# Altium project CommonBoard_FK_H743.PrjPCB
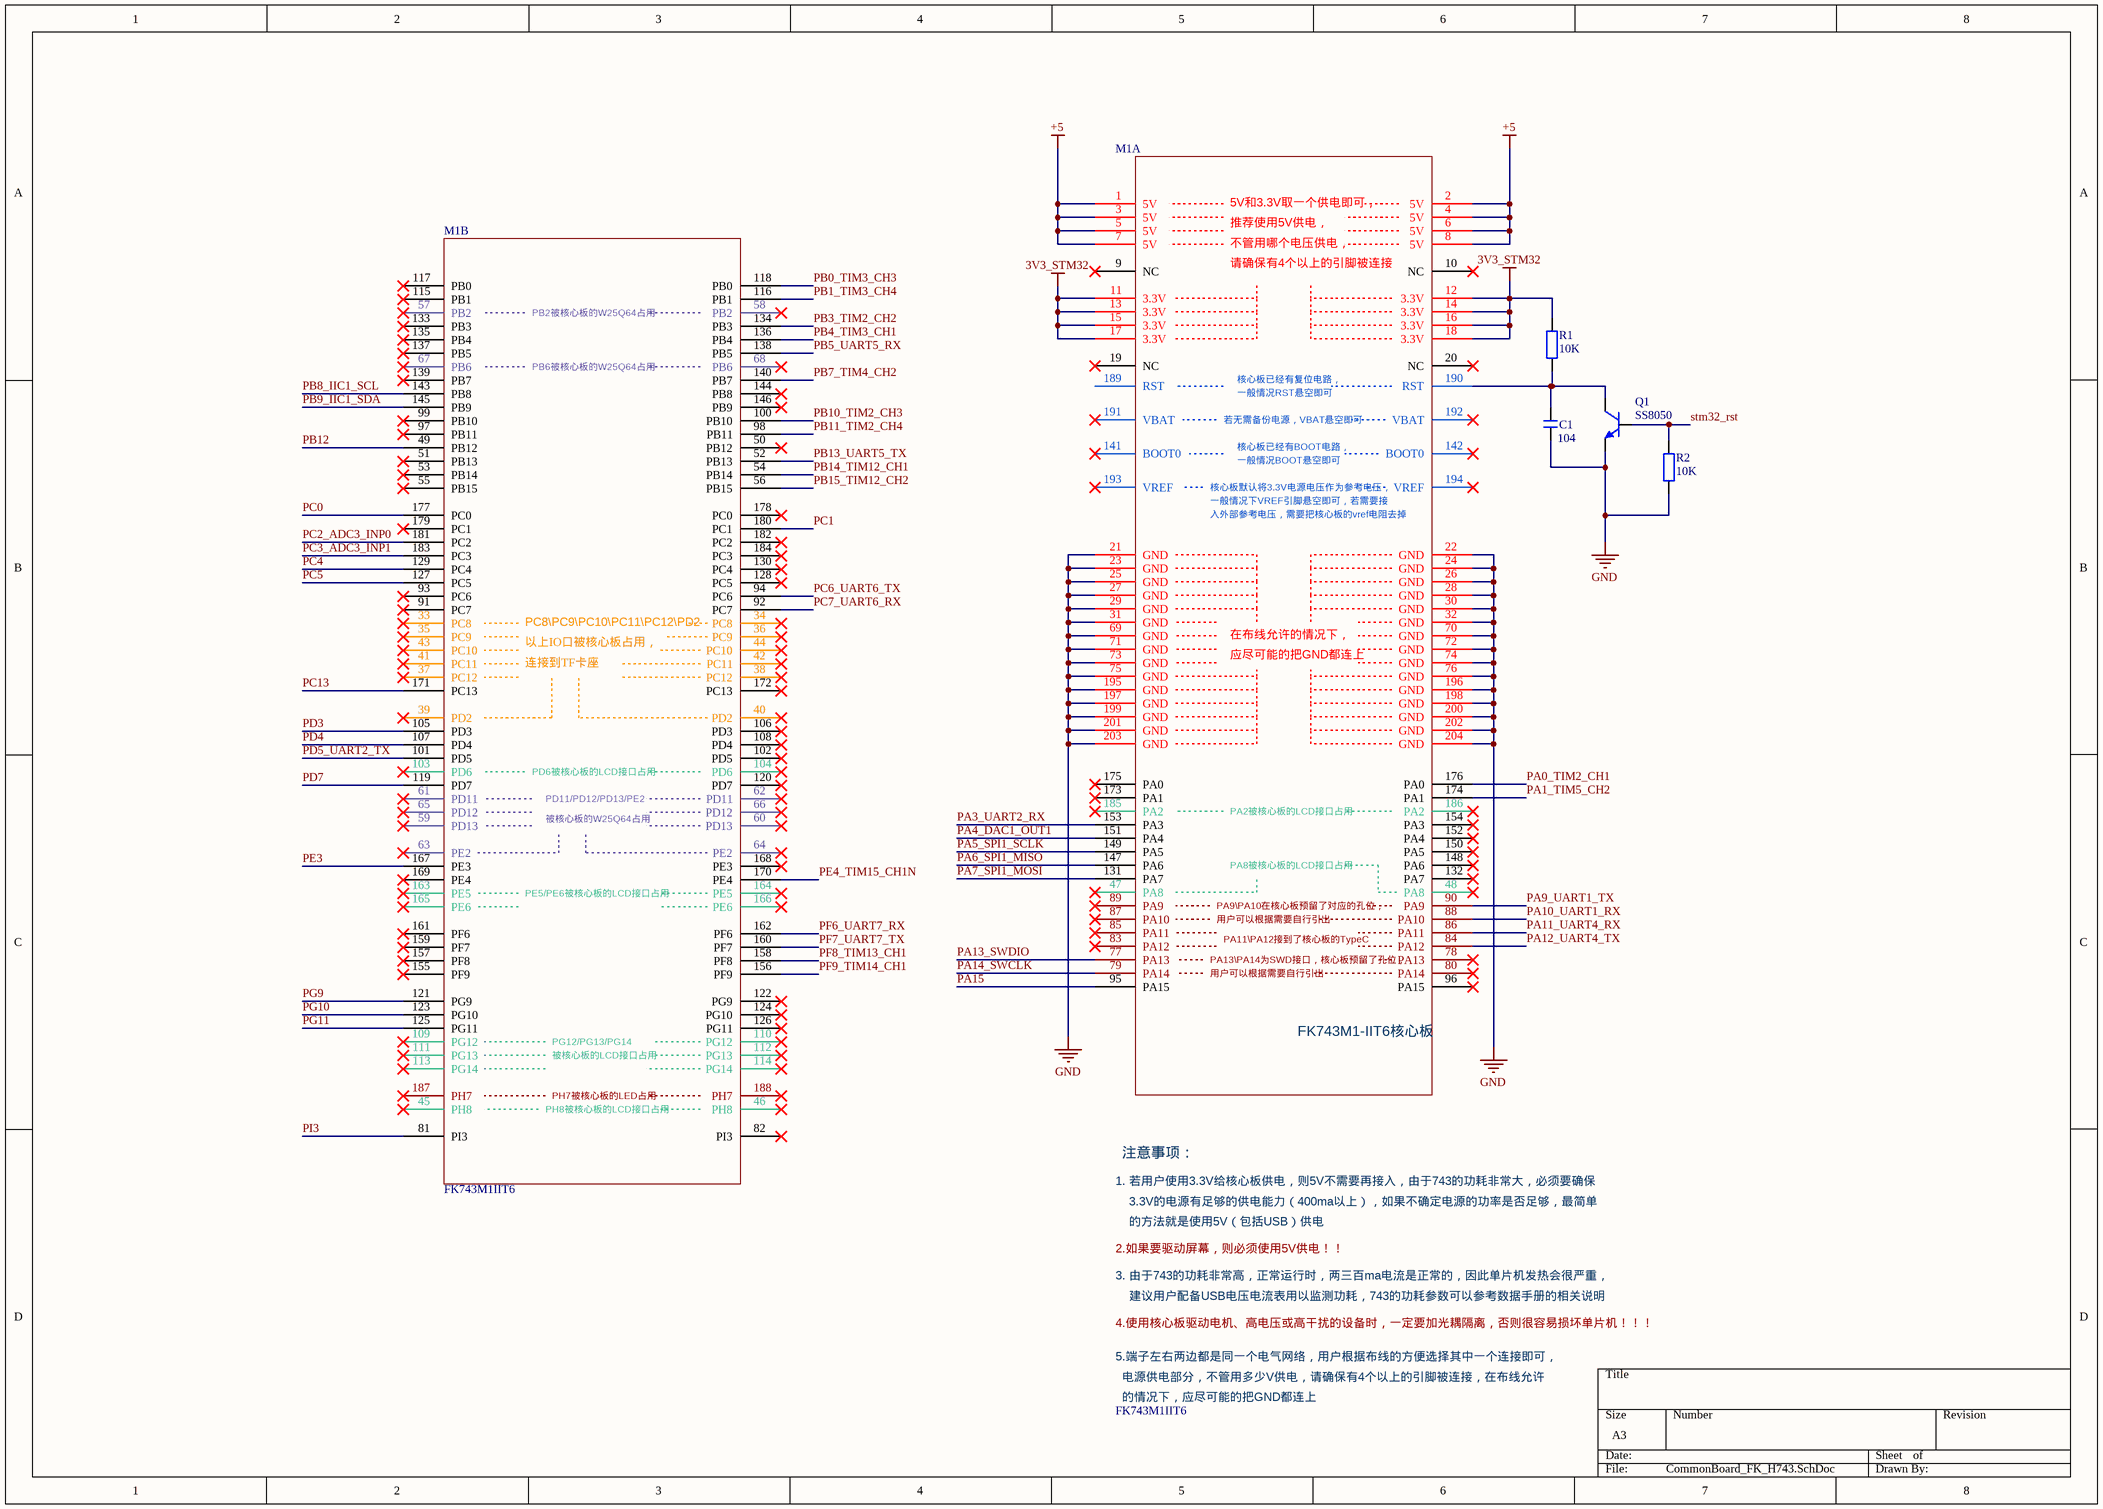
[diagram p0: CommonBoard_FK_H743.SchDoc]
2 sheets, 38 parts. Net scope: global (net labels, ports and power ports of the same name join across sheets).
Board file: CommonBoard_FK_H743.PcbDoc
Sheets:
  CommonBoard_FK_H743.SchDoc
  CommonBoard_FK_H743_out.SchDoc

## Sheet CommonBoard_FK_H743.SchDoc
size A3

### Parts
C1  104  [C 0603_L]
M1  FK743M1IIT6  [FK743M1-IIT6]  (parts A,B of 2)
Q1  SS8050  [SOT23-3N]
R1  10K  [R 0603_L]
R2  10K  [R 0603_L]

### Nets
3V3_STM32: M1.11(3.3V) M1.12(3.3V) M1.13(3.3V) M1.14(3.3V) M1.15(3.3V) M1.16(3.3V) M1.17(3.3V) M1.18(3.3V) R1.2
+5: M1.1(5V) M1.2(5V) M1.3(5V) M1.4(5V) M1.5(5V) M1.6(5V) M1.7(5V) M1.8(5V)
GND: C1.1 M1.21(GND) M1.22(GND) M1.23(GND) M1.24(GND) M1.25(GND) M1.26(GND) M1.27(GND) M1.28(GND) M1.29(GND) M1.30(GND) M1.31(GND) M1.32(GND) M1.69(GND) M1.70(GND) M1.71(GND) M1.72(GND) M1.73(GND) M1.74(GND) M1.75(GND) M1.76(GND) M1.195(GND) M1.196(GND) M1.197(GND) M1.198(GND) M1.199(GND) M1.200(GND) M1.201(GND) M1.202(GND) M1.203(GND) M1.204(GND) Q1.2(E) R2.1
PA0_TIM2_CH1: M1.176(PA0)
PA1_TIM5_CH2: M1.174(PA1)
PA3_UART2_RX: M1.153(PA3)
PA4_DAC1_OUT1: M1.151(PA4)
PA5_SPI1_SCLK: M1.149(PA5)
PA6_SPI1_MISO: M1.147(PA6)
PA7_SPI1_MOSI: M1.131(PA7)
PA9_UART1_TX: M1.90(PA9)
PA10_UART1_RX: M1.88(PA10)
PA11_UART4_RX: M1.86(PA11)
PA12_UART4_TX: M1.84(PA12)
PA13_SWDIO: M1.77(PA13)
PA14_SWCLK: M1.79(PA14)
PA15: M1.95(PA15)
PB0_TIM3_CH3: M1.118(PB0)
PB1_TIM3_CH4: M1.116(PB1)
PB3_TIM2_CH2: M1.134(PB3)
PB4_TIM3_CH1: M1.136(PB4)
PB5_UART5_RX: M1.138(PB5)
PB7_TIM4_CH2: M1.140(PB7)
PB8_IIC1_SCL: M1.143(PB8)
PB9_IIC1_SDA: M1.145(PB9)
PB10_TIM2_CH3: M1.100(PB10)
PB11_TIM2_CH4: M1.98(PB11)
PB12: M1.49(PB12)
PB13_UART5_TX: M1.52(PB13)
PB14_TIM12_CH1: M1.54(PB14)
PB15_TIM12_CH2: M1.56(PB15)
PC0: M1.177(PC0)
PC1: M1.180(PC1)
PC2_ADC3_INP0: M1.181(PC2)
PC3_ADC3_INP1: M1.183(PC3)
PC4: M1.129(PC4)
PC5: M1.127(PC5)
PC6_UART6_TX: M1.94(PC6)
PC7_UART6_RX: M1.92(PC7)
PC13: M1.171(PC13)
PD3: M1.105(PD3)
PD4: M1.107(PD4)
PD5_UART2_TX: M1.101(PD5)
PD7: M1.119(PD7)
PE3: M1.167(PE3)
PE4_TIM15_CH1N: M1.170(PE4)
PF6_UART7_RX: M1.162(PF6)
PF7_UART7_TX: M1.160(PF7)
PF8_TIM13_CH1: M1.158(PF8)
PF9_TIM14_CH1: M1.156(PF9)
PG9: M1.121(PG9)
PG10: M1.123(PG10)
PG11: M1.125(PG11)
PI3: M1.81(PI3)
stm32_rst: Q1.1(B) R2.2
NetC1_2: C1.2 M1.190(RST) Q1.3(C) R1.1

Not connected (* = marked no-connect by the designer): M1 9(NC)* 10(NC)* 19(NC)* 20(NC)* 33(PC8)* 34(PC8)* 35(PC9)* 36(PC9)* 37(PC12)* 38(PC12)* 39(PD2)* 40(PD2)* 41(PC11)* 42(PC11)* 43(PC10)* 44(PC10)* 45(PH8)* 46(PH8)* 47(PA8)* 48(PA8)* 50(PB12)* 51(PB13)* 53(PB14)* 55(PB15)* 57(PB2)* 58(PB2)* 59(PD13)* 60(PD13)* 61(PD11)* 62(PD11)* 63(PE2)* 64(PE2)* 65(PD12)* 66(PD12)* 67(PB6)* 68(PB6)* 78(PA13)* 80(PA14)* 82(PI3)* 83(PA12)* 85(PA11)* 87(PA10)* 89(PA9)* 91(PC7)* 93(PC6)* 96(PA15)* 97(PB11)* 99(PB10)* 102(PD5)* 103(PD6)* 104(PD6)* 106(PD3)* 108(PD4)* 109(PG12)* 110(PG12)* 111(PG13)* 112(PG13)* 113(PG14)* 114(PG14)* 115(PB1)* 117(PB0)* 120(PD7)* 122(PG9)* 124(PG10)* 126(PG11)* 128(PC5)* 130(PC4)* 132(PA7)* 133(PB3)* 135(PB4)* 137(PB5)* 139(PB7)* 141(BOOT0)* 142(BOOT0)* 144(PB8)* 146(PB9)* 148(PA6)* 150(PA5)* 152(PA4)* 154(PA3)* 155(PF9)* 157(PF8)* 159(PF7)* 161(PF6)* 163(PE5)* 164(PE5)* 165(PE6)* 166(PE6)* 168(PE3)* 169(PE4)* 172(PC13)* 173(PA1)* 175(PA0)* 178(PC0)* 179(PC1)* 182(PC2)* 184(PC3)* 185(PA2)* 186(PA2)* 187(PH7)* 188(PH7)* 189(RST) 191(VBAT)* 192(VBAT)* 193(VREF)* 194(VREF)*

### Notes on the sheet
- (in symbol FK743M1-IIT6, part A) 5V和3.3V取一个供电即可，; 推荐使用5V供电，; 不管用哪个电压供电，; 请确保有4个以上的引脚被连接; 核心板已经有复位电路，; 一般情况RST悬空即可; 若无需备份电源，VBAT悬空即可; 核心板已经有BOOT电路，; 一般情况BOOT悬空即可; 核心板默认将3.3V电源电压作为参考电压，; 一般情况下VREF引脚悬空即可，若需要接; 入外部参考电压，需要把核心板的vref电阻去掉; 在布线允许的情况下，; 应尽可能的把GND都连上; PA2被核心板的LCD接口占用; PA8被核心板的LCD接口占用; PA9\PA10在核心板预留了对应的孔位，; 用户可以根据需要自行引出; PA11\PA12接到了核心板的TypeC; PA13\PA14为SWD接口，核心板预留了孔位，; FK743M1-IIT6核心板; 注意事项：; 1. 若用户使用3.3V给核心板供电，则5V不需要再接入，由于743的功耗非常大，必须要确保; 3.3V的电源有足够的供电能力（400ma以上），如果不确定电源的功率是否足够，最简单; 的方法就是使用5V（包括USB）供电; 2.如果要驱动屏幕，则必须使用5V供电！！; 3. 由于743的功耗非常高，正常运行时，两三百ma电流是正常的，因此单片机发热会很严重，; 建议用户配备USB电压电流表用以监测功耗，743的功耗参数可以参考数据手册的相关说明; 4.使用核心板驱动电机、高电压或高干扰的设备时，一定要加光耦隔离，否则很容易损坏单片机！！！; 5.端子左右两边都是同一个电气网络，用户根据布线的方便选择其中一个连接即可，; 电源供电部分，不管用多少V供电，请确保有4个以上的引脚被连接，在布线允许; 的情况下，应尽可能的把GND都连上
- (in symbol FK743M1-IIT6, part B) PB2被核心板的W25Q64占用; PB6被核心板的W25Q64占用; PC8\PC9\PC10\PC11\PC12\PD2; 以上IO口被核心板占用，; 连接到TF卡座; PD6被核心板的LCD接口占用; PD11/PD12/PD13/PE2; 被核心板的W25Q64占用; PE5/PE6被核心板的LCD接口占用; PG12/PG13/PG14; 被核心板的LCD接口占用; PH7被核心板的LED占用; PH8被核心板的LCD接口占用

### Library data of the parts
C1 = C: 无极性贴片电容; 版权归属: 源创客; BOM名称: 无极性贴片电容; 学习资源: www.ooocke.com
M1 = FK743M1-IIT6
Q1 = 8050-SMD: 高频放大-NPN型; 版权归属: 源创客; 属性: 40V 1.5A 1W 100MHZ; BOM名称: 高频放大-NPN型; 学习资源: www.ooocke.com
R1 R2 = R: 贴片电阻; 版权归属: 源创客; BOM名称: 贴片电阻; 学习资源: www.ooocke.com

## Sheet CommonBoard_FK_H743_out.SchDoc
size A3
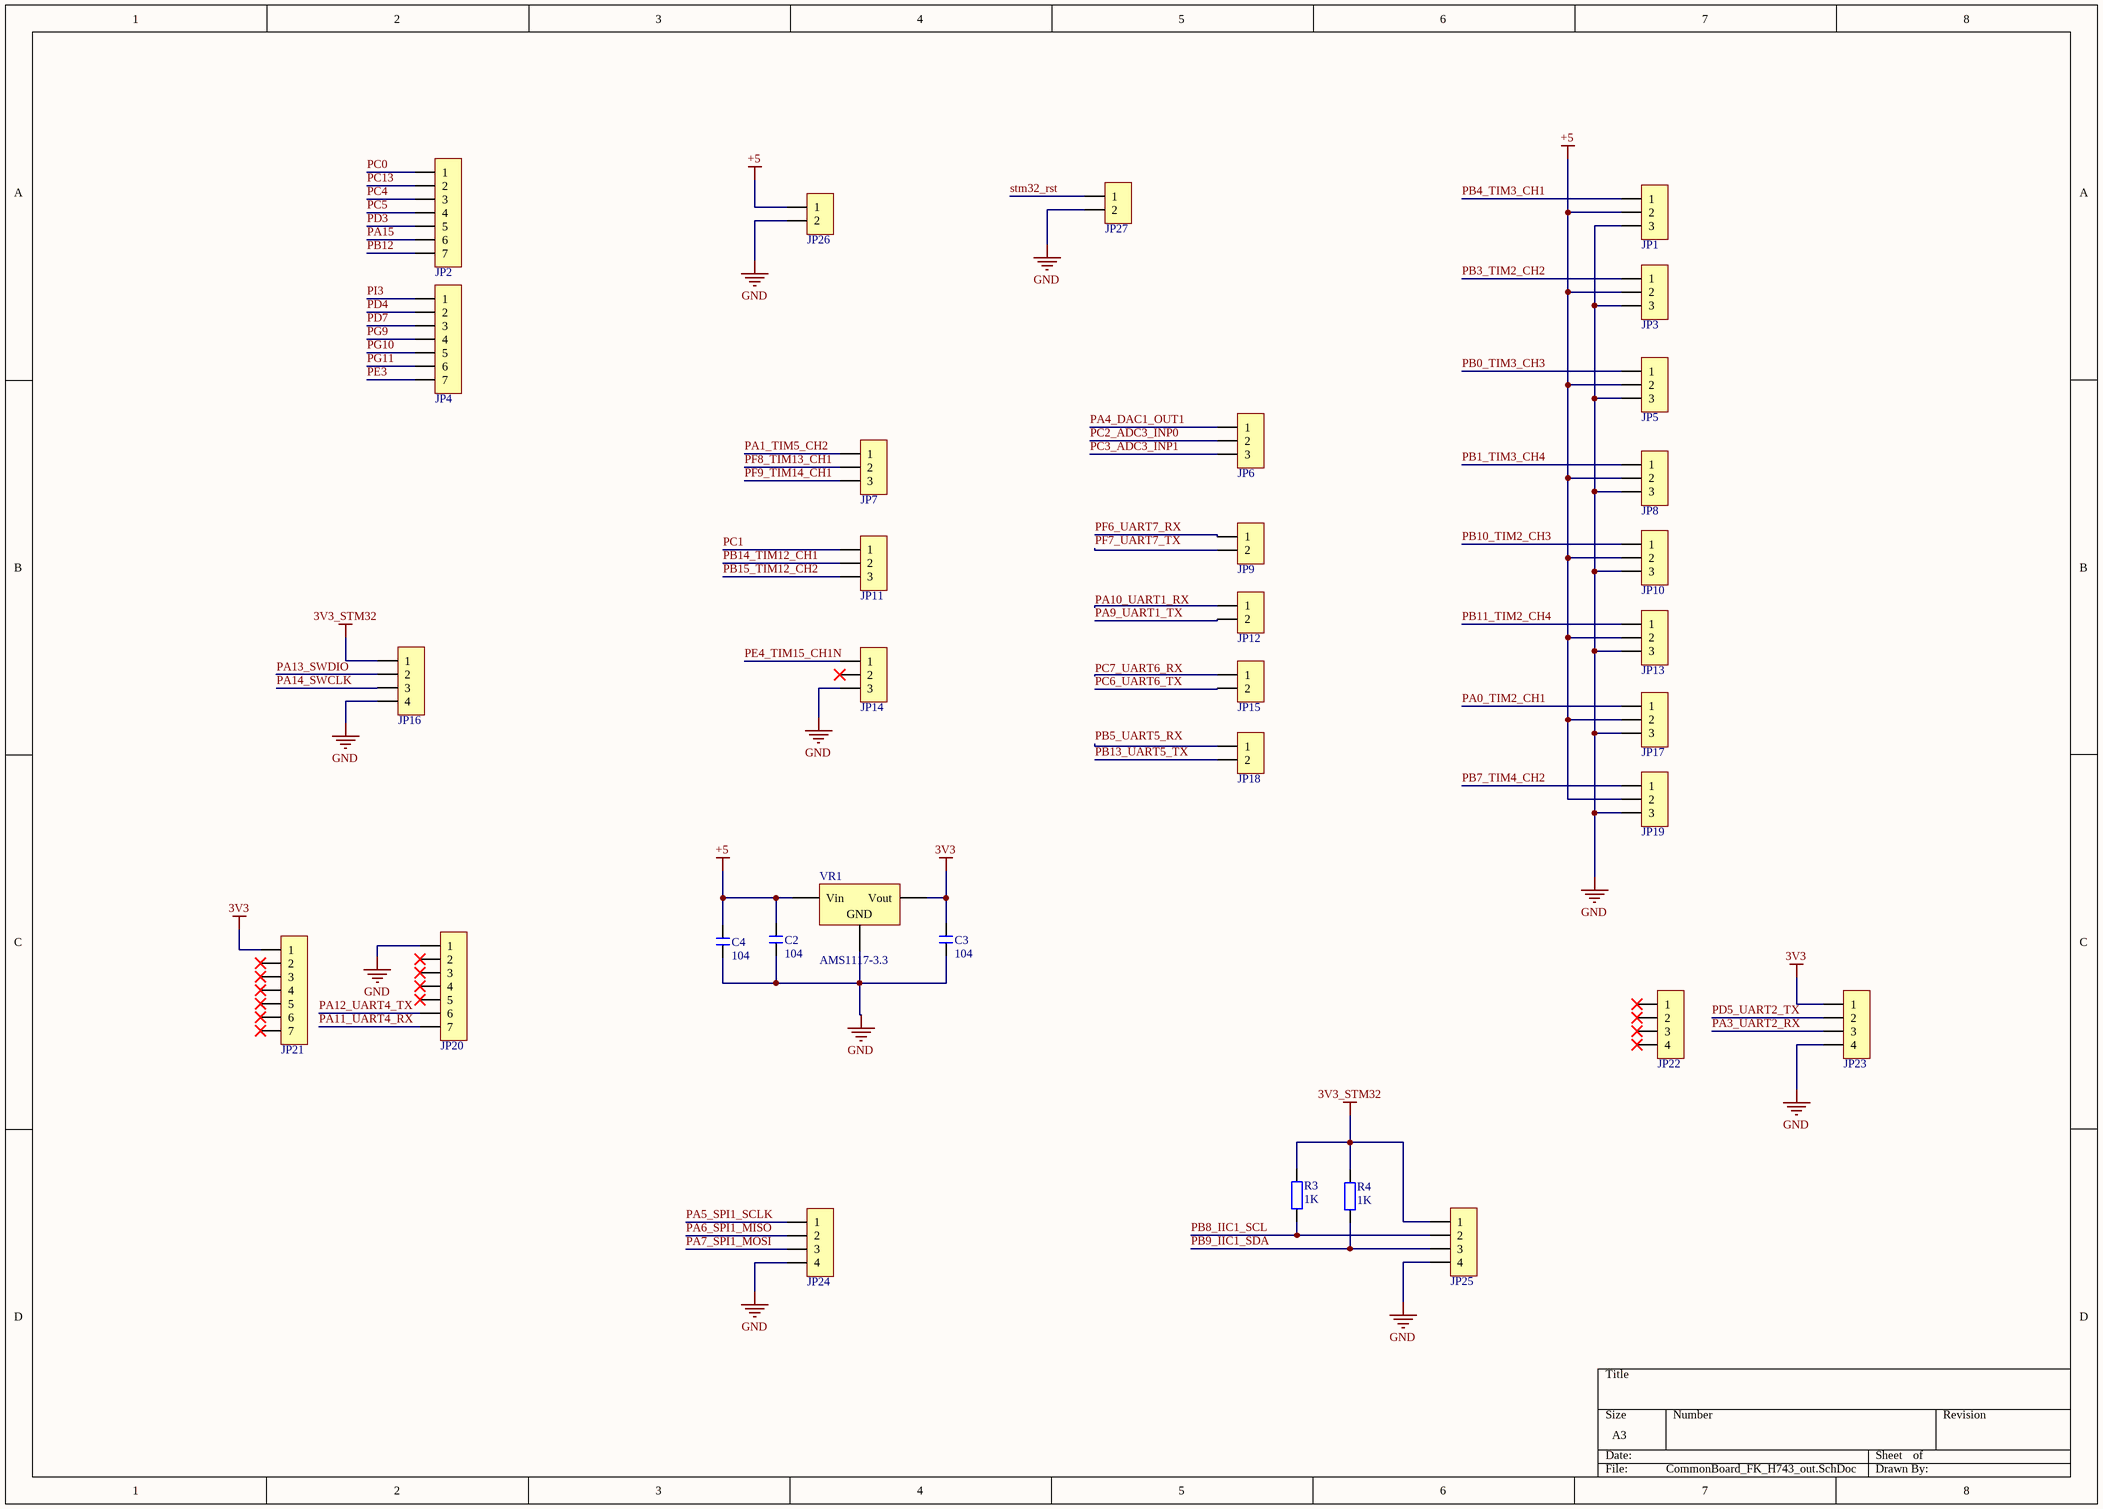
[diagram p1: CommonBoard_FK_H743_out.SchDoc]

### Parts
C2  104  [C 0603_L]
C3  104  [C 0603_L]
C4  104  [C 0603_L]
JP1  HDR-1X3  [HDR2.54-LI-3P]  (value not drawn)
JP2  HDR-1X7  [HDR2.54-LI-7P]  (value not drawn)
JP3  HDR-1X3  [HDR2.54-LI-3P]  (value not drawn)
JP4  HDR-1X7  [HDR2.54-LI-7P]  (value not drawn)
JP5  HDR-1X3  [HDR2.54-LI-3P]  (value not drawn)
JP6  HDR-1X3  [HDR2.54-LI-3P]  (value not drawn)
JP7  HDR-1X3  [HDR2.54-LI-3P]  (value not drawn)
JP8  HDR-1X3  [HDR2.54-LI-3P]  (value not drawn)
JP9  HDR-1X2  [HDR2.54-LI-2P]  (value not drawn)
JP10  HDR-1X3  [HDR2.54-LI-3P]  (value not drawn)
JP11  HDR-1X3  [HDR2.54-LI-3P]  (value not drawn)
JP12  HDR-1X2  [HDR2.54-LI-2P]  (value not drawn)
JP13  HDR-1X3  [HDR2.54-LI-3P]  (value not drawn)
JP14  HDR-1X3  [HDR2.54-LI-3P]  (value not drawn)
JP15  HDR-1X2  [HDR2.54-LI-2P]  (value not drawn)
JP16  HDR-1X4  [HDR2.54-LI-4P]  (value not drawn)
JP17  HDR-1X3  [HDR2.54-LI-3P]  (value not drawn)
JP18  HDR-1X2  [HDR2.54-LI-2P]  (value not drawn)
JP19  HDR-1X3  [HDR2.54-LI-3P]  (value not drawn)
JP20  HDR-1X7  [HDR2.54-LI-7P]  (value not drawn)
JP21  HDR-1X7  [HDR2.54-LI-7P]  (value not drawn)
JP22  HDR-1X4  [HDR2.54-LI-4P]  (value not drawn)
JP23  HDR-1X4  [HDR2.54-LI-4P]  (value not drawn)
JP24  HDR-1X4  [HDR2.54-LI-4P]  (value not drawn)
JP25  HDR-1X4  [HDR2.54-LI-4P]  (value not drawn)
JP26  HDR-1X2  [KF128-3.81-2P]  (value not drawn)
JP27  HDR-1X2  [HDR2.54-LI-2P]  (value not drawn)
R3  1K  [R 0603_L]
R4  1K  [R 0603_L]
VR1  AMS1117-3.3  [SOT-223]

### Nets
3V3: C3.2 JP21.1 JP23.1 VR1.2(Vout)
3V3_STM32: JP16.1 JP25.1 R3.1 R4.1
+5: C2.2 C4.2 JP1.2 JP3.2 JP5.2 JP8.2 JP10.2 JP13.2 JP17.2 JP19.2 JP26.1 VR1.3(Vin)
GND: C2.1 C3.1 C4.1 JP1.3 JP3.3 JP5.3 JP8.3 JP10.3 JP13.3 JP14.3 JP16.4 JP17.3 JP19.3 JP20.1 JP23.4 JP24.4 JP25.4 JP26.2 JP27.2 VR1.1(GND)
PA0_TIM2_CH1: JP17.1
PA1_TIM5_CH2: JP7.1
PA3_UART2_RX: JP23.3
PA4_DAC1_OUT1: JP6.1
PA5_SPI1_SCLK: JP24.1
PA6_SPI1_MISO: JP24.2
PA7_SPI1_MOSI: JP24.3
PA9_UART1_TX: JP12.2
PA10_UART1_RX: JP12.1
PA11_UART4_RX: JP20.7
PA12_UART4_TX: JP20.6
PA13_SWDIO: JP16.2
PA14_SWCLK: JP16.3
PA15: JP2.6
PB0_TIM3_CH3: JP5.1
PB1_TIM3_CH4: JP8.1
PB3_TIM2_CH2: JP3.1
PB4_TIM3_CH1: JP1.1
PB5_UART5_RX: JP18.1
PB7_TIM4_CH2: JP19.1
PB8_IIC1_SCL: JP25.2 R3.2
PB9_IIC1_SDA: JP25.3 R4.2
PB10_TIM2_CH3: JP10.1
PB11_TIM2_CH4: JP13.1
PB12: JP2.7
PB13_UART5_TX: JP18.2
PB14_TIM12_CH1: JP11.2
PB15_TIM12_CH2: JP11.3
PC0: JP2.1
PC1: JP11.1
PC2_ADC3_INP0: JP6.2
PC3_ADC3_INP1: JP6.3
PC4: JP2.3
PC5: JP2.4
PC6_UART6_TX: JP15.2
PC7_UART6_RX: JP15.1
PC13: JP2.2
PD3: JP2.5
PD4: JP4.2
PD5_UART2_TX: JP23.2
PD7: JP4.3
PE3: JP4.7
PE4_TIM15_CH1N: JP14.1
PF6_UART7_RX: JP9.1
PF7_UART7_TX: JP9.2
PF8_TIM13_CH1: JP7.2
PF9_TIM14_CH1: JP7.3
PG9: JP4.4
PG10: JP4.5
PG11: JP4.6
PI3: JP4.1
stm32_rst: JP27.1

Not connected (* = marked no-connect by the designer): JP14 2*; JP20 2* 3* 4* 5*; JP21 2* 3* 4* 5* 6* 7*; JP22 1* 2* 3* 4*

### Library data of the parts
C2-C4 = C: 无极性贴片电容; 版权归属: 源创客; BOM名称: 无极性贴片电容; 学习资源: www.ooocke.com
JP1 JP3 JP5-JP8 JP10 JP11 JP13 JP14 JP17 JP19 = Header 3: 3P接插件; 版权归属: 源创客; BOM名称: 3P接插件; 学习资源: www.ooocke.com
JP2 JP4 JP20 JP21 = Header 7: 7P接插件; 版权归属: 源创客; BOM名称: 7P接插件; 学习资源: www.ooocke.com
JP9 JP12 JP15 JP18 JP26 JP27 = Header 2: 2P接插件; 版权归属: 源创客; BOM名称: 2P接插件; 学习资源: www.ooocke.com
JP16 JP22-JP25 = Header 4: 4P接插件; 版权归属: 源创客; BOM名称: 4P接插件; 学习资源: www.ooocke.com
R3 R4 = R: 贴片电阻; 版权归属: 源创客; BOM名称: 贴片电阻; 学习资源: www.ooocke.com
VR1 = SOT-223 AMS1117-3.3: 低压差线性稳压(LDO); ComponentLink1Description: 供应商链接; ComponentLink1URL: http://www.szlcsc.com/product/details_6652.html; Package: SOT-223; Supplier: LC; SuppliersPartNumber: C6186

## Nets that join several sheets
3V3_STM32: CommonBoard_FK_H743 (9 pins), CommonBoard_FK_H743_out (JP16.1 JP25.1 R3.1 R4.1)
+5: CommonBoard_FK_H743 (8 pins), CommonBoard_FK_H743_out (12 pins)
GND: CommonBoard_FK_H743 (33 pins), CommonBoard_FK_H743_out (20 pins)
PA0_TIM2_CH1: CommonBoard_FK_H743 (M1.176), CommonBoard_FK_H743_out (JP17.1)
PA1_TIM5_CH2: CommonBoard_FK_H743 (M1.174), CommonBoard_FK_H743_out (JP7.1)
PA3_UART2_RX: CommonBoard_FK_H743 (M1.153), CommonBoard_FK_H743_out (JP23.3)
PA4_DAC1_OUT1: CommonBoard_FK_H743 (M1.151), CommonBoard_FK_H743_out (JP6.1)
PA5_SPI1_SCLK: CommonBoard_FK_H743 (M1.149), CommonBoard_FK_H743_out (JP24.1)
PA6_SPI1_MISO: CommonBoard_FK_H743 (M1.147), CommonBoard_FK_H743_out (JP24.2)
PA7_SPI1_MOSI: CommonBoard_FK_H743 (M1.131), CommonBoard_FK_H743_out (JP24.3)
PA9_UART1_TX: CommonBoard_FK_H743 (M1.90), CommonBoard_FK_H743_out (JP12.2)
PA10_UART1_RX: CommonBoard_FK_H743 (M1.88), CommonBoard_FK_H743_out (JP12.1)
PA11_UART4_RX: CommonBoard_FK_H743 (M1.86), CommonBoard_FK_H743_out (JP20.7)
PA12_UART4_TX: CommonBoard_FK_H743 (M1.84), CommonBoard_FK_H743_out (JP20.6)
PA13_SWDIO: CommonBoard_FK_H743 (M1.77), CommonBoard_FK_H743_out (JP16.2)
PA14_SWCLK: CommonBoard_FK_H743 (M1.79), CommonBoard_FK_H743_out (JP16.3)
PA15: CommonBoard_FK_H743 (M1.95), CommonBoard_FK_H743_out (JP2.6)
PB0_TIM3_CH3: CommonBoard_FK_H743 (M1.118), CommonBoard_FK_H743_out (JP5.1)
PB1_TIM3_CH4: CommonBoard_FK_H743 (M1.116), CommonBoard_FK_H743_out (JP8.1)
PB3_TIM2_CH2: CommonBoard_FK_H743 (M1.134), CommonBoard_FK_H743_out (JP3.1)
PB4_TIM3_CH1: CommonBoard_FK_H743 (M1.136), CommonBoard_FK_H743_out (JP1.1)
PB5_UART5_RX: CommonBoard_FK_H743 (M1.138), CommonBoard_FK_H743_out (JP18.1)
PB7_TIM4_CH2: CommonBoard_FK_H743 (M1.140), CommonBoard_FK_H743_out (JP19.1)
PB8_IIC1_SCL: CommonBoard_FK_H743 (M1.143), CommonBoard_FK_H743_out (JP25.2 R3.2)
PB9_IIC1_SDA: CommonBoard_FK_H743 (M1.145), CommonBoard_FK_H743_out (JP25.3 R4.2)
PB10_TIM2_CH3: CommonBoard_FK_H743 (M1.100), CommonBoard_FK_H743_out (JP10.1)
PB11_TIM2_CH4: CommonBoard_FK_H743 (M1.98), CommonBoard_FK_H743_out (JP13.1)
PB12: CommonBoard_FK_H743 (M1.49), CommonBoard_FK_H743_out (JP2.7)
PB13_UART5_TX: CommonBoard_FK_H743 (M1.52), CommonBoard_FK_H743_out (JP18.2)
PB14_TIM12_CH1: CommonBoard_FK_H743 (M1.54), CommonBoard_FK_H743_out (JP11.2)
PB15_TIM12_CH2: CommonBoard_FK_H743 (M1.56), CommonBoard_FK_H743_out (JP11.3)
PC0: CommonBoard_FK_H743 (M1.177), CommonBoard_FK_H743_out (JP2.1)
PC1: CommonBoard_FK_H743 (M1.180), CommonBoard_FK_H743_out (JP11.1)
PC2_ADC3_INP0: CommonBoard_FK_H743 (M1.181), CommonBoard_FK_H743_out (JP6.2)
PC3_ADC3_INP1: CommonBoard_FK_H743 (M1.183), CommonBoard_FK_H743_out (JP6.3)
PC4: CommonBoard_FK_H743 (M1.129), CommonBoard_FK_H743_out (JP2.3)
PC5: CommonBoard_FK_H743 (M1.127), CommonBoard_FK_H743_out (JP2.4)
PC6_UART6_TX: CommonBoard_FK_H743 (M1.94), CommonBoard_FK_H743_out (JP15.2)
PC7_UART6_RX: CommonBoard_FK_H743 (M1.92), CommonBoard_FK_H743_out (JP15.1)
PC13: CommonBoard_FK_H743 (M1.171), CommonBoard_FK_H743_out (JP2.2)
PD3: CommonBoard_FK_H743 (M1.105), CommonBoard_FK_H743_out (JP2.5)
PD4: CommonBoard_FK_H743 (M1.107), CommonBoard_FK_H743_out (JP4.2)
PD5_UART2_TX: CommonBoard_FK_H743 (M1.101), CommonBoard_FK_H743_out (JP23.2)
PD7: CommonBoard_FK_H743 (M1.119), CommonBoard_FK_H743_out (JP4.3)
PE3: CommonBoard_FK_H743 (M1.167), CommonBoard_FK_H743_out (JP4.7)
PE4_TIM15_CH1N: CommonBoard_FK_H743 (M1.170), CommonBoard_FK_H743_out (JP14.1)
PF6_UART7_RX: CommonBoard_FK_H743 (M1.162), CommonBoard_FK_H743_out (JP9.1)
PF7_UART7_TX: CommonBoard_FK_H743 (M1.160), CommonBoard_FK_H743_out (JP9.2)
PF8_TIM13_CH1: CommonBoard_FK_H743 (M1.158), CommonBoard_FK_H743_out (JP7.2)
PF9_TIM14_CH1: CommonBoard_FK_H743 (M1.156), CommonBoard_FK_H743_out (JP7.3)
PG9: CommonBoard_FK_H743 (M1.121), CommonBoard_FK_H743_out (JP4.4)
PG10: CommonBoard_FK_H743 (M1.123), CommonBoard_FK_H743_out (JP4.5)
PG11: CommonBoard_FK_H743 (M1.125), CommonBoard_FK_H743_out (JP4.6)
PI3: CommonBoard_FK_H743 (M1.81), CommonBoard_FK_H743_out (JP4.1)
stm32_rst: CommonBoard_FK_H743 (Q1.1 R2.2), CommonBoard_FK_H743_out (JP27.1)